# Altium schematic sheet HYDRA_V4_LINK.SchDoc
size C; SheetNumber: 1; SheetTotal: 10
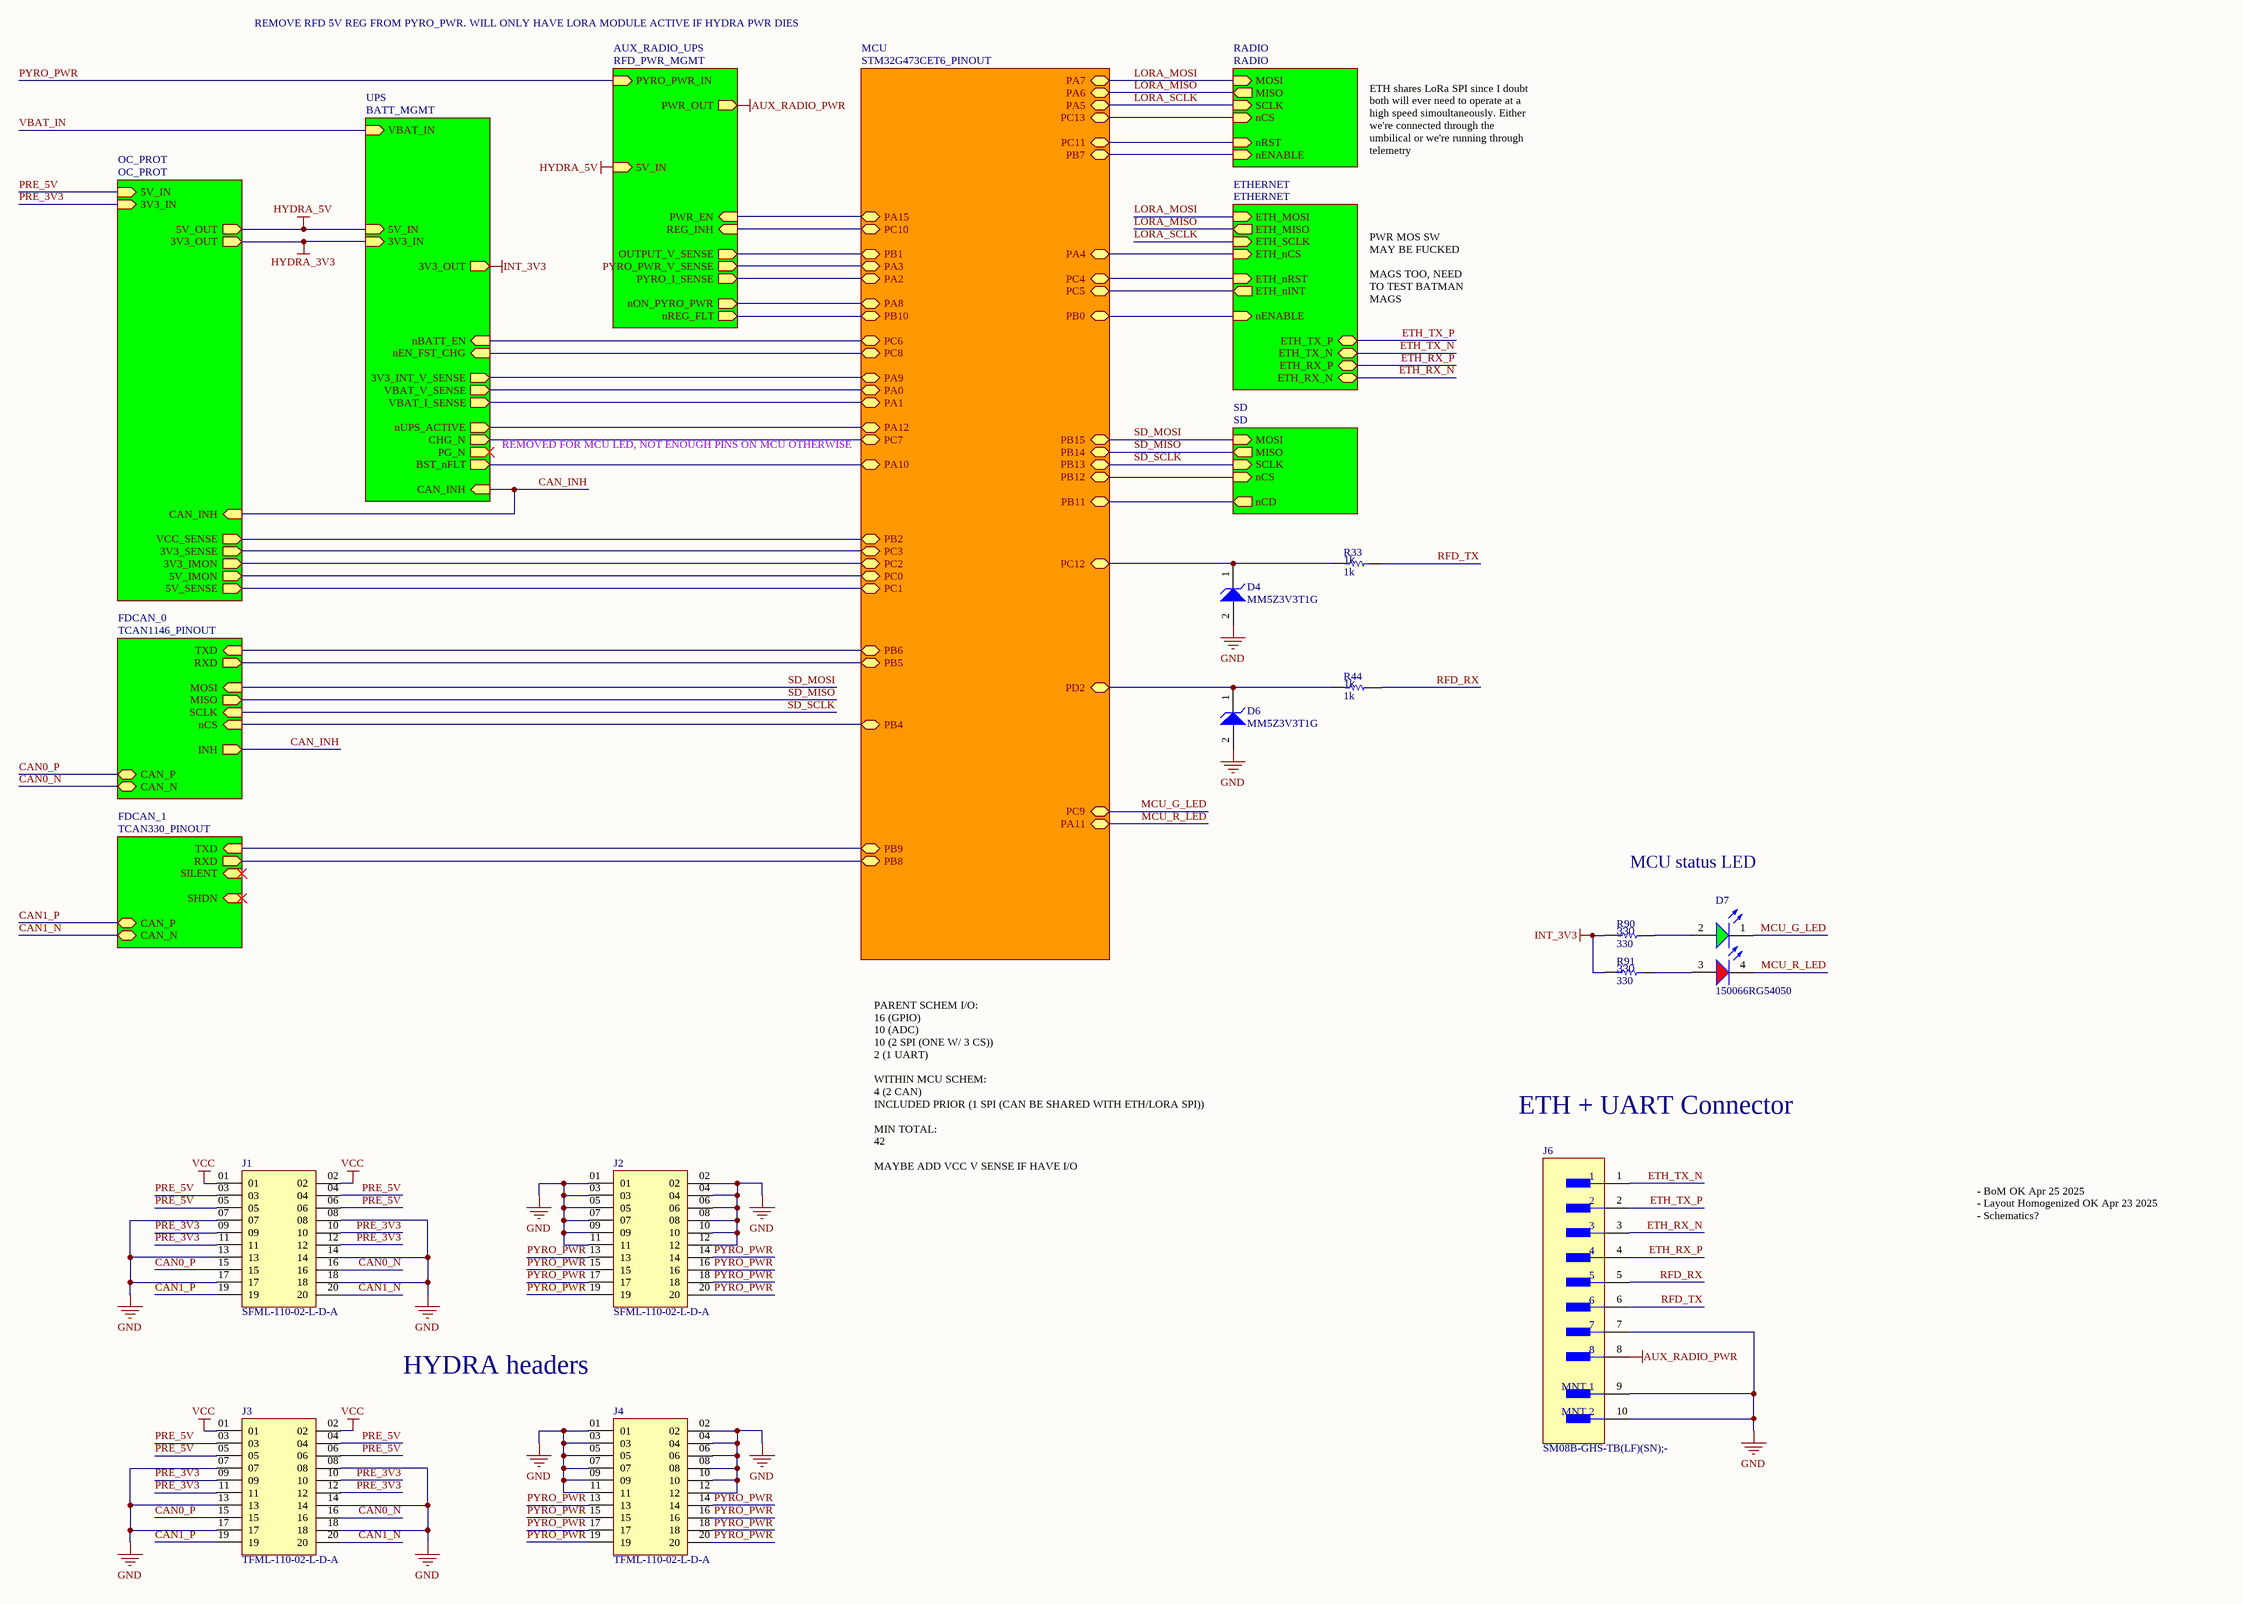
[diagram p0: HYDRA_V4_LINK.SchDoc]

## Parts
D4  MM5Z3V3T1G  [ONSC-SOD-523-2-502-01_V]
D6  MM5Z3V3T1G  [ONSC-SOD-523-2-502-01_V]
D7  150066RG54050  [WL-SBCD_0606]
J1  SFML-110-02-L-D-A  [SFML-110-02-L-D-A-Footprint-1]
J2  SFML-110-02-L-D-A  [SFML-110-02-L-D-A-Footprint-1]
J3  TFML-110-02-L-D-A  [TFML-110-02-L-D-A-Footprint-1]
J4  TFML-110-02-L-D-A  [TFML-110-02-L-D-A-Footprint-1]
J6  SM08B-GHS-TB(LF)(SN);-  [SM08B-GHS-TB(LF)(SN);--Footprint-1]
R33  1k  [R0603B]
R44  1k  [R0603B]
R90  330  [R0603B]
R91  330  [R0603B]

## Sub-sheets
AUX_RADIO_UPS = RFD_PWR_MGMT: 5V_IN (in), PYRO_PWR_IN (in), PWR_OUT (out), PWR_EN (in), OUTPUT_V_SENSE (out), PYRO_PWR_V_SENSE (out), PYRO_I_SENSE (out), nON_PYRO_PWR (out), nREG_FLT (out), REG_INH (in)
ETHERNET = ETHERNET: ETH_MOSI (in), ETH_MISO (out), ETH_SCLK (in), ETH_nCS (in), ETH_nRST (in), ETH_nINT (out), ETH_TX_P (bidir), ETH_TX_N (bidir), ETH_RX_P (bidir), ETH_RX_N (bidir), nENABLE (in)
FDCAN_0 = TCAN1146_PINOUT: TXD (in), RXD (out), MOSI (in), MISO (out), SCLK (in), nCS (in), INH (out), CAN_P (bidir), CAN_N (bidir)
FDCAN_1 = TCAN330_PINOUT: TXD (in), RXD (out), SHDN (in), SILENT (in), CAN_P (bidir), CAN_N (bidir)
MCU = STM32G473CET6_PINOUT: PA4 (bidir), PA5 (bidir), PA6 (bidir), PA7 (bidir), PC4 (bidir), PC5 (bidir), PC12 (bidir), PD2 (bidir), PB5 (bidir), PB6 (bidir), PB4 (bidir), PB9 (bidir), PB8 (bidir), PB12 (bidir), PB13 (bidir), PB14 (bidir), PB15 (bidir), PB11 (bidir), PC13 (bidir), PB7 (bidir), PA15 (bidir), PC10 (bidir), PC0 (bidir), PC1 (bidir), PC2 (bidir), PC3 (bidir), PA0 (bidir), PA1 (bidir), PA2 (bidir), PA3 (bidir), PB2 (bidir), PB1 (bidir), PA9 (bidir), PB0 (bidir), PC11 (bidir), PB10 (bidir), PC6 (bidir), PC7 (bidir), PC8 (bidir), PC9 (bidir), PA8 (bidir), PA10 (bidir), PA12 (bidir), PA11 (bidir)
OC_PROT = OC_PROT: 5V_IN (in), 3V3_IN (in), 5V_OUT (out), 3V3_OUT (out), CAN_INH (in), 3V3_SENSE (out), 3V3_IMON (out), 5V_IMON (out), 5V_SENSE (out), VCC_SENSE (out)
RADIO = RADIO: MOSI (in), MISO (out), SCLK (in), nCS (in), nRST (in), nENABLE (in)
SD = SD: MOSI (in), MISO (out), SCLK (in), nCS (in), nCD (out)
UPS = BATT_MGMT: 5V_IN (in), 3V3_IN (in), 3V3_OUT (out), VBAT_IN (in), nBATT_EN (in), nEN_FST_CHG (in), VBAT_V_SENSE (out), 3V3_INT_V_SENSE (out), VBAT_I_SENSE (out), nUPS_ACTIVE (out), CHG_N (out), PG_N (out), BST_nFLT (out), CAN_INH (in)

## Nets
AUX_RADIO_PWR: J6.8 ; sheet AUX_RADIO_UPS/PWR_OUT
GND: D4.2(A) D6.2(A) J1.07 J1.08 J1.13 J1.14 J1.17 J1.18 J2.01 J2.02 J2.03 J2.04 J2.05 J2.06 J2.07 J2.08 J2.09 J2.10 J2.11 J2.12 J3.07 J3.08 J3.13 J3.14 J3.17 J3.18 J4.01 J4.02 J4.03 J4.04 J4.05 J4.06 J4.07 J4.08 J4.09 J4.10 J4.11 J4.12 J6.7 J6.9(MNT_1) J6.10(MNT_2)
HYDRA_3V3: sheet OC_PROT/3V3_OUT, sheet UPS/3V3_IN
HYDRA_5V: sheet OC_PROT/5V_OUT, sheet UPS/5V_IN, sheet AUX_RADIO_UPS/5V_IN
INT_3V3: R90.2 R91.2 ; sheet UPS/3V3_OUT
VCC: J1.01 J1.02 J3.01 J3.02
CAN0_N: J1.16 J3.16 ; sheet FDCAN_0/CAN_N
CAN0_P: J1.15 J3.15 ; sheet FDCAN_0/CAN_P
CAN1_N: J1.20 J3.20 ; sheet FDCAN_1/CAN_N
CAN1_P: J1.19 J3.19 ; sheet FDCAN_1/CAN_P
CAN_INH: sheet OC_PROT/CAN_INH, sheet UPS/CAN_INH, sheet FDCAN_0/INH
ETH_RX_N: J6.3 ; sheet ETHERNET/ETH_RX_N
ETH_RX_P: J6.4 ; sheet ETHERNET/ETH_RX_P
ETH_TX_N: J6.1 ; sheet ETHERNET/ETH_TX_N
ETH_TX_P: J6.2 ; sheet ETHERNET/ETH_TX_P
LORA_MISO: sheet MCU/PA6, sheet ETHERNET/ETH_MISO, sheet RADIO/MISO
LORA_MOSI: sheet MCU/PA7, sheet ETHERNET/ETH_MOSI, sheet RADIO/MOSI
LORA_SCLK: sheet MCU/PA5, sheet ETHERNET/ETH_SCLK, sheet RADIO/SCLK
MCU_G_LED: D7.1(K) ; sheet MCU/PC9
MCU_R_LED: D7.4(K) ; sheet MCU/PA11
PRE_3V3: J1.09 J1.10 J1.11 J1.12 J3.09 J3.10 J3.11 J3.12 ; sheet OC_PROT/3V3_IN
PRE_5V: J1.03 J1.04 J1.05 J1.06 J3.03 J3.04 J3.05 J3.06 ; sheet OC_PROT/5V_IN
PYRO_PWR: J2.13 J2.14 J2.15 J2.16 J2.17 J2.18 J2.19 J2.20 J4.13 J4.14 J4.15 J4.16 J4.17 J4.18 J4.19 J4.20 ; sheet AUX_RADIO_UPS/PYRO_PWR_IN
RFD_RX: J6.5 R44.1
RFD_TX: J6.6 R33.1
SD_MISO: sheet MCU/PB14, sheet SD/MISO, sheet FDCAN_0/MISO
SD_MOSI: sheet MCU/PB15, sheet SD/MOSI, sheet FDCAN_0/MOSI
SD_SCLK: sheet MCU/PB13, sheet SD/SCLK, sheet FDCAN_0/SCLK
VBAT_IN: sheet UPS/VBAT_IN
NetD4_1: D4.1(K) R33.2 ; sheet MCU/PC12
NetD6_1: D6.1(K) R44.2 ; sheet MCU/PD2
NetD7_2: D7.2(A) R90.1
NetD7_3: D7.3(A) R91.1
(unnamed): sheet OC_PROT/3V3_SENSE, sheet MCU/PC3
(unnamed): sheet OC_PROT/3V3_IMON, sheet MCU/PC2
(unnamed): sheet OC_PROT/5V_IMON, sheet MCU/PC0
(unnamed): sheet OC_PROT/5V_SENSE, sheet MCU/PC1
(unnamed): sheet OC_PROT/VCC_SENSE, sheet MCU/PB2
(unnamed): sheet UPS/nBATT_EN, sheet MCU/PC6
(unnamed): sheet UPS/nEN_FST_CHG, sheet MCU/PC8
(unnamed): sheet UPS/VBAT_V_SENSE, sheet MCU/PA0
(unnamed): sheet UPS/3V3_INT_V_SENSE, sheet MCU/PA9
(unnamed): sheet UPS/VBAT_I_SENSE, sheet MCU/PA1
(unnamed): sheet UPS/nUPS_ACTIVE, sheet MCU/PA12
(unnamed): sheet UPS/CHG_N, sheet MCU/PC7
(unnamed): sheet UPS/BST_nFLT, sheet MCU/PA10
(unnamed): sheet MCU/PA4, sheet ETHERNET/ETH_nCS
(unnamed): sheet MCU/PC4, sheet ETHERNET/ETH_nRST
(unnamed): sheet MCU/PC5, sheet ETHERNET/ETH_nINT
(unnamed): sheet MCU/PB5, sheet FDCAN_0/RXD
(unnamed): sheet MCU/PB6, sheet FDCAN_0/TXD
(unnamed): sheet MCU/PB4, sheet FDCAN_0/nCS
(unnamed): sheet MCU/PB9, sheet FDCAN_1/TXD
(unnamed): sheet MCU/PB8, sheet FDCAN_1/RXD
(unnamed): sheet MCU/PB12, sheet SD/nCS
(unnamed): sheet MCU/PB11, sheet SD/nCD
(unnamed): sheet MCU/PC13, sheet RADIO/nCS
(unnamed): sheet MCU/PB7, sheet RADIO/nENABLE
(unnamed): sheet MCU/PA15, sheet AUX_RADIO_UPS/PWR_EN
(unnamed): sheet MCU/PC10, sheet AUX_RADIO_UPS/REG_INH
(unnamed): sheet MCU/PA2, sheet AUX_RADIO_UPS/PYRO_I_SENSE
(unnamed): sheet MCU/PA3, sheet AUX_RADIO_UPS/PYRO_PWR_V_SENSE
(unnamed): sheet MCU/PB1, sheet AUX_RADIO_UPS/OUTPUT_V_SENSE
(unnamed): sheet MCU/PB0, sheet ETHERNET/nENABLE
(unnamed): sheet MCU/PC11, sheet RADIO/nRST
(unnamed): sheet MCU/PB10, sheet AUX_RADIO_UPS/nREG_FLT
(unnamed): sheet MCU/PA8, sheet AUX_RADIO_UPS/nON_PYRO_PWR

## Notes on the sheet
- REMOVE RFD 5V REG FROM PYRO_PWR. WILL ONLY HAVE LORA MODULE ACTIVE IF HYDRA PWR DIES
- ETH shares LoRa SPI since I doubt both will ever need to operate at a high speed simoultaneously. Either we're connected through the umbilical or we're running through telemetry
- PWR MOS SW MAY BE FUCKED
  MAGS TOO, NEED TO TEST BATMAN MAGS
- REMOVED FOR MCU LED, NOT ENOUGH PINS ON MCU OTHERWISE
- MCU status LED
- ETH + UART Connector
- PARENT SCHEM I/O:
  16 (GPIO)
  10 (ADC)
  10 (2 SPI (ONE W/ 3 CS))
  2 (1 UART)
  WITHIN MCU SCHEM:
  4 (2 CAN)
  INCLUDED PRIOR (1 SPI (CAN BE SHARED WITH ETH/LORA SPI))
  MIN TOTAL:
  42
  MAYBE ADD VCC V SENSE IF HAVE I/O
- - BoM OK Apr 25 2025
  - Layout Homogenized OK Apr 23 2025
  - Schematics?
- HYDRA headers

## Library data of the parts
D4 D6 = CMP-1060-00750-1: Zener Voltage Regulator, 500 mW, 2-Pin SOD-523, Pb-Free, Tape and Reel; Manufacturer: On Semiconductor; P Max (W): 0.5; VZ Typ (V): 3.3; RoHS: Pb-Free; ComponentLink2Description: Datasheet; PackageReference: SOD-523-2-502-01; DatasheetVersion: Rev. 10; ComponentLink1Description: Manufacturer URL; PackageVersion: Rev. E, 09/2010; ComponentLink3URL: http://www.onsemi.com/pub_link/Collateral/502-01.PDF; ComponentLink2URL: http://www.onsemi.cn/pub_link/Collateral/MM5Z2V4T1-D.PDF; Mounting Technology: Surface Mount; PartNumber: MM5Z3V3T1G; Packing: Tape and Reel; PackageDescription: 2-Pin SOD, Body 1.2 x 0.8 mm; ComponentLink1URL: http://www.onsemi.com/; ComponentLink3Description: Package Specification
D7 = CMP-004-00040-2: Led, Red/Grn, 180Mcd/230Mcd, 624Nm/525Nm Rohs Compliant: Yes; Source: rgled.SchLib; Component Type: Standard; Design Item ID: CMP-004-00034-2; Pins: 4
J1 J2 = CMP-002-00043-1: Board Connector, 20 Contact(s), 2 Row(s), Female, Straight, 0.05 inch Pitch, Surface Mount Terminal, Locking, Black Insulator, Socket; RoHS Compliant: Yes; Connector Type: BOARD CONNECTOR; Mounting Technology: Board
J3 J4 = CMP-002-00042-3: Board Connector, 20 Contact(s), 2 Row(s), Male, Straight, Surface Mount Terminal; Connector Type: BOARD CONNECTOR; Mounting Technology: Board; RoHS Compliant: Yes
J6 = CMP-002-00079-3: Connector Header, GH Series, 8 Position, 1.25mm, 30-26 AWG, 50V, Surface Mount, Right Angle, Solder, Locking Ramp
R33 R44 R90 R91 = CMP-009-00002-14: Resistor
  R33 R44: Value: 1k
  R90 R91: Value: 330